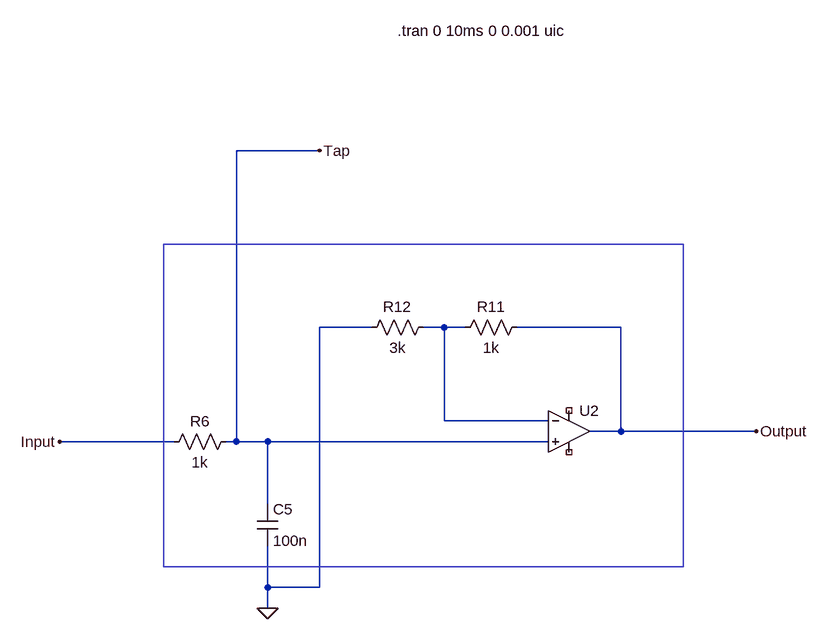
[diagram p0: schematic delay.asc]
delay.asc, the LTspice schematic file:
Version 4
SHEET 1 5460 1956
WIRE 704 880 576 880
WIRE 784 1152 704 1152
WIRE 896 1152 864 1152
WIRE 928 1152 896 1152
WIRE 1168 1152 1008 1152
WIRE 896 1296 896 1152
WIRE 1056 1296 896 1296
WIRE 1168 1312 1168 1152
WIRE 1168 1312 1120 1312
WIRE 1376 1312 1168 1312
WIRE 480 1328 304 1328
WIRE 576 1328 576 880
WIRE 576 1328 560 1328
WIRE 624 1328 576 1328
WIRE 1056 1328 624 1328
WIRE 624 1424 624 1328
WIRE 624 1552 624 1488
WIRE 704 1552 704 1152
WIRE 704 1552 624 1552
WIRE 624 1584 624 1552
FLAG 624 1584 0
FLAG 304 1328 Input
FLAG 1376 1312 Output
FLAG 704 880 Tap
SYMBOL res 576 1312 R90
WINDOW 0 0 56 VBottom 2
WINDOW 3 32 56 VTop 2
SYMATTR InstName R6
SYMATTR Value 1k
SYMATTR SpiceLine tol=1 pwr=0.1
SYMBOL cap 608 1424 R0
SYMATTR InstName C5
SYMATTR Value 100n
SYMBOL res 1024 1136 R90
WINDOW 0 0 56 VBottom 2
WINDOW 3 32 56 VTop 2
SYMATTR InstName R11
SYMATTR Value 1k
SYMBOL res 880 1136 R90
WINDOW 0 0 56 VBottom 2
WINDOW 3 32 56 VTop 2
SYMATTR InstName R12
SYMATTR Value 3k
SYMBOL OpAmps\\UniversalOpAmp1 1088 1312 R0
SYMATTR InstName U2
TEXT 824 696 Left 2 !.tran 0 10ms 0 0.001 uic
RECTANGLE Normal 1264 1520 464 1024

The netlist it stands for:
* delay.asc
R6 Tap Input 1k tol=1 pwr=0.1
C5 Tap 0 100n
R11 Output N001 1k
R12 N001 0 3k
XU2 Tap N001 NC_01 NC_02 Output level1 Avol=1Meg GBW=10Meg Vos=0 En=0 Enk=0 In=0 Ink=0 Rin=500Meg  ; pins In+ In- V+ V- OUT
.tran 0 10ms 0 0.001 uic
.lib UniversalOpAmp1.lib
.backanno
.end